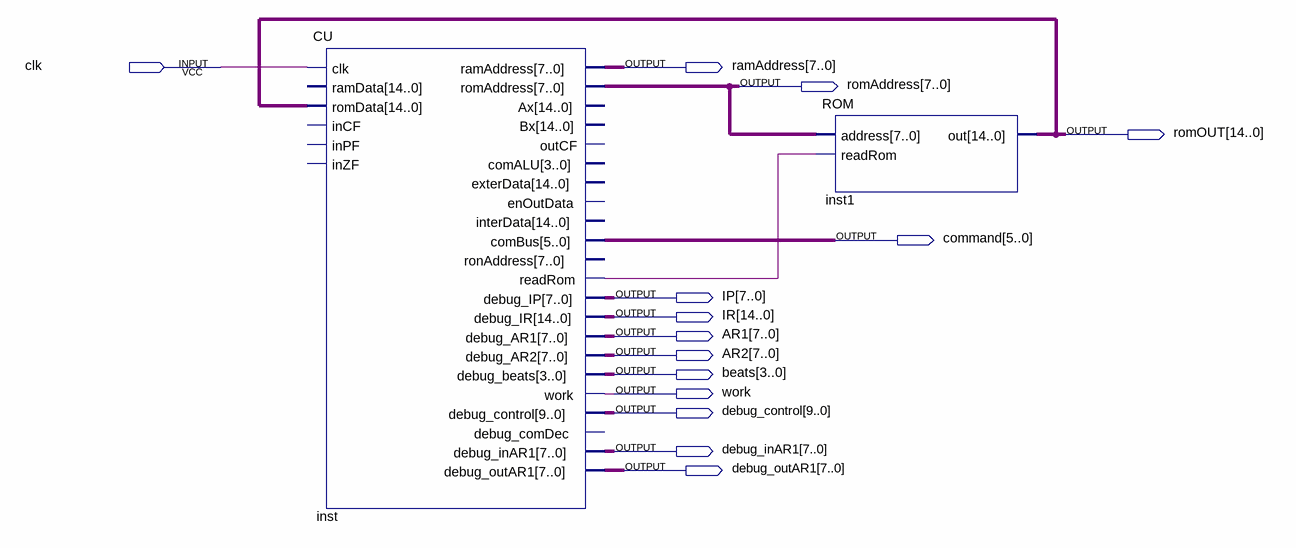
[diagram p0: schematic sheet]
// Quartus schematic test.bdf as structural Verilog: 2 symbols, 14 pins
module test (
  input  clk,
  output [7:0] ramAddress,
  output [7:0] romAddress,
  output [14:0] romOUT,
  output [5:0] command,
  output [7:0] IP,
  output [14:0] IR,
  output [7:0] AR1,
  output [7:0] AR2,
  output [3:0] beats,
  output work,
  output [9:0] debug_control,
  output [7:0] debug_inAR1,
  output [7:0] debug_outAR1
);

  wire inst_readrom;

  CU inst (
    .clk(clk), .romData(romOUT), .ramAddress(ramAddress), .romAddress(romAddress), .comBus(command),
    .readRom(inst_readrom), .debug_IP(IP), .debug_IR(IR), .debug_AR1(AR1), .debug_AR2(AR2),
    .debug_beats(beats), .work(work), .debug_control(debug_control), .debug_inAR1(debug_inAR1),
    .debug_outAR1(debug_outAR1));  // open: ramData, inCF, inPF, inZF, Ax, Bx, outCF, comALU, exterData, enOutData, interData, ronAddress, debug_comDec
  ROM inst1 (.address(romAddress), .readRom(inst_readrom), .out(romOUT));
endmodule
